# EAGLE schematic LightSensorWiring (EAGLE 7.6.0)
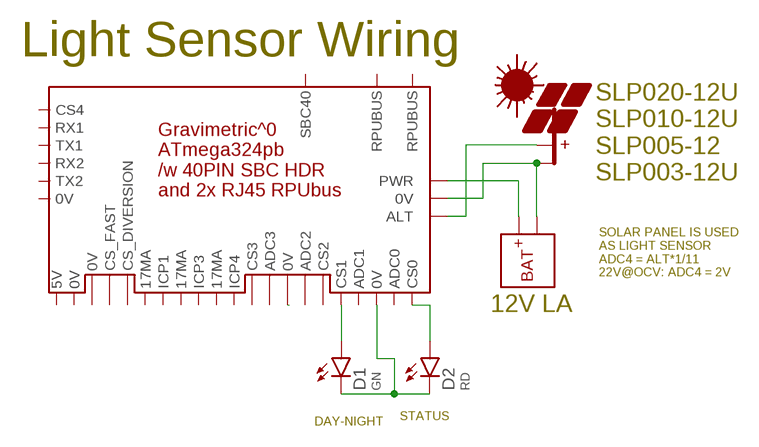
[diagram p0: schematic, sheet 1]

## Parts
D1  GN  LED5MM  [LED5MM]
D2  RD  LED5MM  [LED5MM]
PV4  PV  [NA-30]
U$1  GRAVIMETRIC  [WITH_RPU_NAMES]
U$7  BAT  [NA-30]

## Nets
0V: PV4.2(-PV) U$1.0V@PWR(0V) U$7.2(-BAT)
GN-WHT: U$1.0V@ADC2(0V)
N$1: U$1.PWR U$7.1(+BAT)
N$2: D1.A U$1.22MA@ADC0(CS1)
N$3: D2.A U$1.22MA@ADC1(CS0)
N$4: D1.K D2.K U$1.0V@ADC1(0V)
N$34: PV4.1(+PV) U$1.BAT(ALT)
Unconnected: U$1.0V U$1.0V@DIO2(0V) U$1.0V@DIO9(0V) U$1.5V U$1.17MA@ICP1(17MA) U$1.17MA@ICP3(17MA) U$1.17MA@ICP4(17MA) U$1.22MA@ADC2(CS2) U$1.22MA@ADC3(CS3) U$1.22MA@ADC4(CS4) U$1.22MA@DIO2(CS_DIVERSION) U$1.22MA@DIO9(CS_FAST) U$1.+RX(RPUBUS) U$1.+TX(RPUBUS) U$1.ADC0(ADC1) U$1.ADC1(ADC0) U$1.ADC2 U$1.ADC3 U$1.ICP1 U$1.ICP3 U$1.ICP4 U$1.K1(RX1) U$1.K2(RX2) U$1.K3(TX1) U$1.K4(TX2) U$1.SPI(SBC40)

## Notes on the sheet
- Light Sensor Wiring
- SLP020-12U
  SLP010-12U
  SLP005-12
  SLP003-12U
- SOLAR PANEL IS USED 
  AS LIGHT SENSOR 
  ADC4 = ALT*1/11
  22V@OCV: ADC4 = 2V
- 12V LA
- STATUS
- DAY-NIGHT

## Library data of the parts
D1 D2 = D-LED:LED: LED 120120WH [CREE,XHGAWT-00-0000-00000HXE1] LED WHITE 6500K 150LUM-W120120
PV4 = Documentation:PV
U$1 = Documentation:GRAVIMETRIC: Gravimetric /w ATmega324pb
U$7 = Documentation:BAT